# Altium schematic sheet RT1064_Power.SchDoc
size A4; SheetNumber: 4; SheetTotal: 4
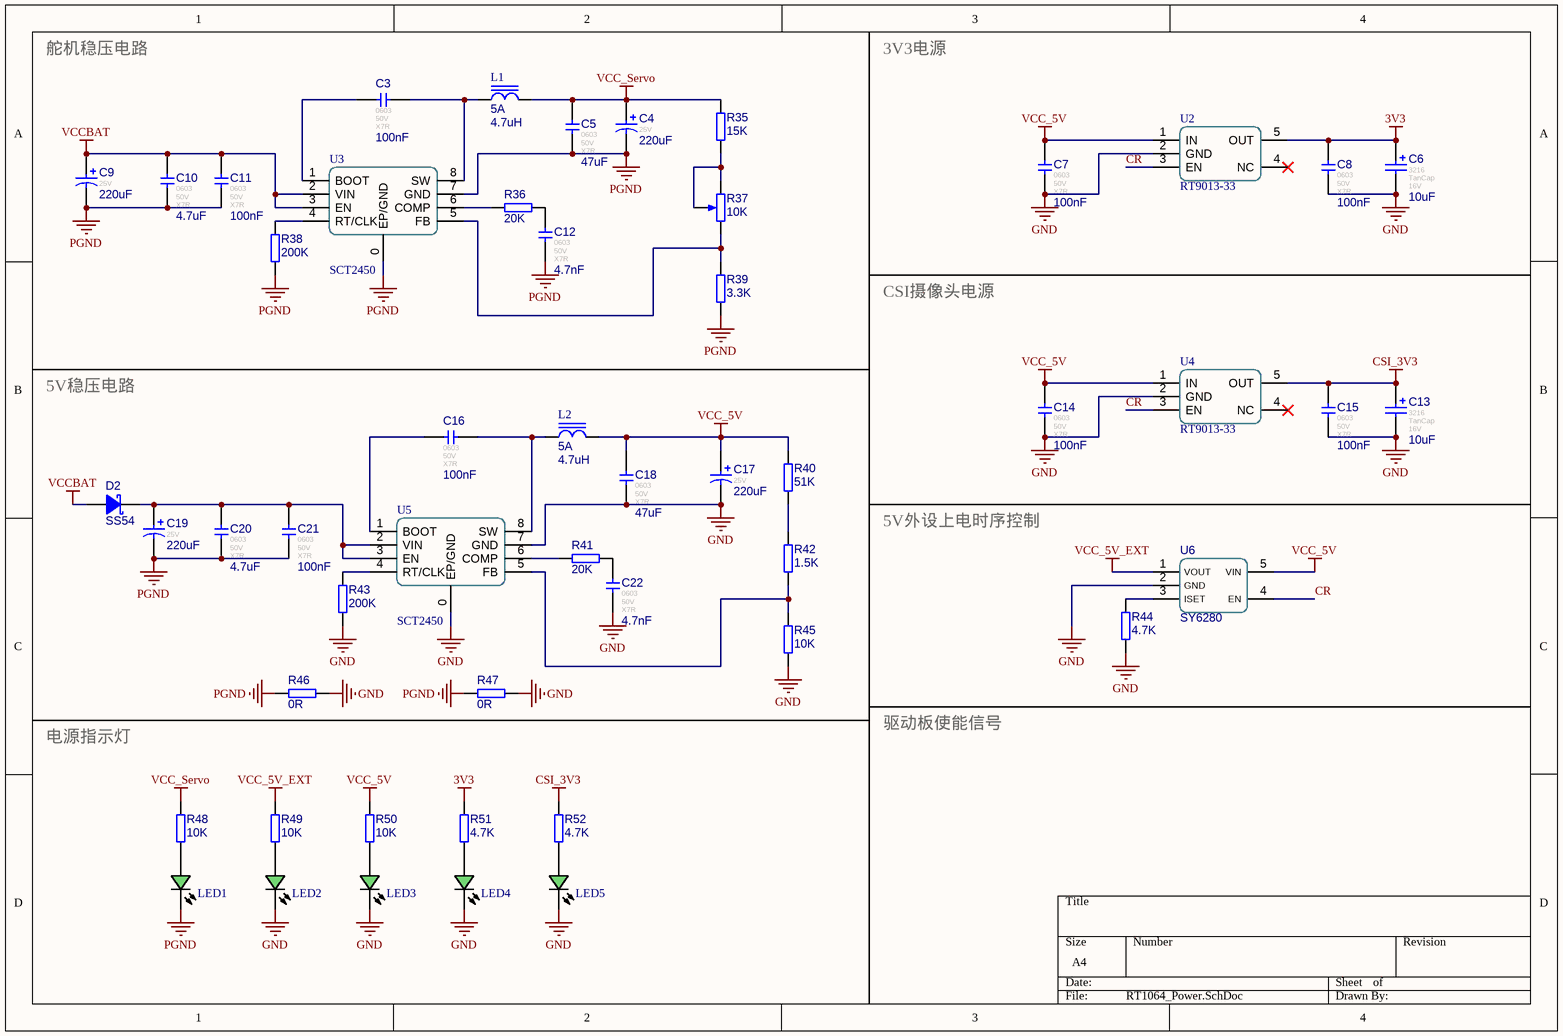
[diagram p0: RT1064_Power.SchDoc]

## Parts
C3  value 100nF  FootPrint: 0603  Voltage: 50V  Type: X7R  [CAPC1608[0603]S-L]  (hidden comment: 100nF 50V X7R)
C4  value 220uF  Voltage: 25V  [CAP-E-S 6.3]  (hidden comment: 220uF 25V 铝电解)
C5  value 47uF  FootPrint: 0603  Voltage: 50V  Type: X7R  [CAPC1608[0603]S-L]  (hidden comment: 47uF 50V X7R)
C6  value 10uF  FootPrint: 3216  Type: TanCap  Voltage: 16V  [CAP-T-S 3216]  (hidden comment: T-S 10uF 3216 16V)
C7  value 100nF  FootPrint: 0603  Voltage: 50V  Type: X7R  [CAPC1608[0603]S-L]  (hidden comment: 100nF 50V X7R)
C8  value 100nF  FootPrint: 0603  Voltage: 50V  Type: X7R  [CAPC1608[0603]S-L]  (hidden comment: 100nF 50V X7R)
C9  value 220uF  Voltage: 25V  [CAP-E-S 6.3]  (hidden comment: 220uF 25V 铝电解)
C10  value 4.7uF  FootPrint: 0603  Voltage: 50V  Type: X7R  [CAPC1608[0603]S-L]  (hidden comment: 4.7uF 50V X7R)
C11  value 100nF  FootPrint: 0603  Voltage: 50V  Type: X7R  [CAPC1608[0603]S-L]  (hidden comment: 100nF 50V X7R)
C12  value 4.7nF  FootPrint: 0603  Voltage: 50V  Type: X7R  [CAPC1608[0603]S-L]  (hidden comment: 4.7nF 50V X7R)
C13  value 10uF  FootPrint: 3216  Type: TanCap  Voltage: 16V  [CAP-T-S 3216]  (hidden comment: T-S 10uF 3216 16V)
C14  value 100nF  FootPrint: 0603  Voltage: 50V  Type: X7R  [CAPC1608[0603]S-L]  (hidden comment: 100nF 50V X7R)
C15  value 100nF  FootPrint: 0603  Voltage: 50V  Type: X7R  [CAPC1608[0603]S-L]  (hidden comment: 100nF 50V X7R)
C16  value 100nF  FootPrint: 0603  Voltage: 50V  Type: X7R  [CAPC1608[0603]S-L]  (hidden comment: 100nF 50V X7R)
C17  value 220uF  Voltage: 25V  [CAP-E-S 6.3]  (hidden comment: 220uF 25V 铝电解)
C18  value 47uF  FootPrint: 0603  Voltage: 50V  Type: X7R  [CAPC1608[0603]S-L]  (hidden comment: 47uF 50V X7R)
C19  value 220uF  Voltage: 25V  [CAP-E-S 6.3]  (hidden comment: 220uF 25V 铝电解)
C20  value 4.7uF  FootPrint: 0603  Voltage: 50V  Type: X7R  [CAPC1608[0603]S-L]  (hidden comment: 4.7uF 50V X7R)
C21  value 100nF  FootPrint: 0603  Voltage: 50V  Type: X7R  [CAPC1608[0603]S-L]  (hidden comment: 100nF 50V X7R)
C22  value 4.7nF  FootPrint: 0603  Voltage: 50V  Type: X7R  [CAPC1608[0603]S-L]  (hidden comment: 4.7nF 50V X7R)
D2  SS54  [SMA-L[DO-214AC]]
L1  value 4.7uH  Imax: 5A  [0630 TPC 7*7*3]  (hidden comment: 4.7uH 5A)
L2  value 4.7uH  Imax: 5A  [0630 TPC 7*7*3]  (hidden comment: 4.7uH 5A)
LED1  翠绿贴片LED  [LEDC1608(0603)-L]  (value not drawn)
LED2  翠绿贴片LED  [LEDC1608(0603)-L]  (value not drawn)
LED3  翠绿贴片LED  [LEDC1608(0603)-L]  (value not drawn)
LED4  翠绿贴片LED  [LEDC1608(0603)-L]  (value not drawn)
LED5  翠绿贴片LED  [LEDC1608(0603)-L]  (value not drawn)
R35  value 15K  [RESC1608[0603]S-L]  (hidden comment: 15K ±1%)
R36  value 20K  [RESC1608[0603]S-L]  (hidden comment: 20K ±1%)
R37  10K  [RESPOT3296W]
R38  value 200K  [RESC1608[0603]S-L]  (hidden comment: 200K ±1%)
R39  value 3.3K  [RESC1608[0603]S-L]  (hidden comment: 3.3K ±1%)
R40  value 51K  [RESC1608[0603]S-L]  (hidden comment: 51K ±1%)
R41  value 20K  [RESC1608[0603]S-L]  (hidden comment: 20K ±1%)
R42  value 1.5K  [RESC1608[0603]S-L]  (hidden comment: 1.5K ±1%)
R43  value 200K  [RESC1608[0603]S-L]  (hidden comment: 200K ±1%)
R44  value 4.7K  [RESC1608[0603]S-L]  (hidden comment: 4.7K ±1%)
R45  value 10K  [RESC1608[0603]S-L]  (hidden comment: 10K ±1%)
R46  value 0R  [RESC1608[0603]S-L]  (hidden comment: 0R ±1%)
R47  value 0R  [RESC1608[0603]S-L]  (hidden comment: 0R ±1%)
R48  value 10K  [RESC1608[0603]S-L]  (hidden comment: 10K ±1%)
R49  value 10K  [RESC1608[0603]S-L]  (hidden comment: 10K ±1%)
R50  value 10K  [RESC1608[0603]S-L]  (hidden comment: 10K ±1%)
R51  value 4.7K  [RESC1608[0603]S-L]  (hidden comment: 4.7K ±1%)
R52  value 4.7K  [RESC1608[0603]S-L]  (hidden comment: 4.7K ±1%)
U2  RT9013-33  [SOT-23-5]
U3  SCT2450  [SOP-8E]
U4  RT9013-33  [SOT-23-5]
U5  SCT2450  [SOP-8E]
U6  SY6280  [SOT-23-5]

## Nets
3V3: C6.1 C8.2 R51.2 U2.5(OUT)
CSI_3V3: C13.1 C15.2 R52.2 U4.5(OUT)
GND: C6.2 C7.1 C8.1 C13.2 C14.1 C15.1 C17.2 C18.1 C22.1 LED2.C LED3.C LED4.C LED5.C R43.1 R44.1 R45.1 R46.2 R47.2 U2.2(GND) U4.2(GND) U5.0(EP/GND) U5.7(GND) U6.2(GND)
PGND: C4.2 C5.1 C9.2 C10.1 C11.1 C12.1 C19.2 C20.1 C21.1 LED1.C R38.1 R39.1 R46.1 R47.1 U3.0(EP/GND) U3.7(GND)
VCC_5V: C7.2 C14.2 C17.1 C18.2 L2.2 R40.2 R50.2 U2.1(IN) U4.1(IN) U6.5(VIN)
VCC_5V_EXT: R49.2 U6.1(VOUT)
VCC_Servo: C4.1 C5.2 L1.2 R35.2 R48.2
VCCBAT: C9.1 C10.2 C11.2 D2.A U3.2(VIN) U3.3(EN)
CR: U2.3(EN) U4.3(EN) U6.4(EN)
NetC3_1: C3.1 L1.1 U3.8(SW)
NetC3_2: C3.2 U3.1(BOOT)
NetC12_2: C12.2 R36.1
NetC16_1: C16.1 L2.1 U5.8(SW)
NetC16_2: C16.2 U5.1(BOOT)
NetC19_1: C19.1 C20.2 C21.2 D2.K U5.2(VIN) U5.3(EN)
NetC22_2: C22.2 R41.1
NetLED1_A: LED1.A R48.1
NetLED2_A: LED2.A R49.1
NetLED3_A: LED3.A R50.1
NetLED4_A: LED4.A R51.1
NetLED5_A: LED5.A R52.1
NetR35_1: R35.1 R37.1(TOP) R37.ADJ
NetR36_2: R36.2 U3.6(COMP)
NetR37_2: R37.2(BOT) R39.2 U3.5(FB)
NetR38_2: R38.2 U3.4(RT/CLK)
NetR40_1: R40.1 R42.2
NetR41_2: R41.2 U5.6(COMP)
NetR42_1: R42.1 R45.2 U5.5(FB)
NetR43_2: R43.2 U5.4(RT/CLK)
NetR44_2: R44.2 U6.3(ISET)

Not connected (* = marked no-connect by the designer): U2 4(NC)*; U4 4(NC)*

## Notes on the sheet
- 舵机稳压电路
- 3V3电源
- CSI摄像头电源
- 5V稳压电路
- 5V外设上电时序控制
- 电源指示灯
- 驱动板使能信号

## Library data of the parts
C3 C5 C7 C8 C10 C11 C14-C16 C18 C20 C21 = 100nF 0603 50V X7R: 贴片瓷片电容; MLCC; 0603(1608);; Revision: V1.0
C4 C9 C17 C19 = E-S 220uF 25V 6.3x7.7: 贴片电解电容 220uF 25V 6.3x7.7; Revision: V1.0; Type: 铝电解
C6 C13 = T-S 10uF 3216 16V: 贴片钽电容 10uF 3216 16V; Revision: July-2002: Re-released for DXP Platform.
C12 C22 = 4.7nF 0603 50V X7R: 贴片瓷片电容; MLCC; 0603(1608);; Revision: V1.0
D2 = SS54: SS54 肖特基二极管; Revision: V1.0; Value: SS54
L1 L2 = Ind-Power: 功率电感; DCR: .5m; Published: 8-Jun-2000; Revision: July-2002: Re-released for DXP Platform.; Publisher: Altium Limited; Price(RMB): 0.000
LED1-LED5 = LED Chip Green: Published: 8-Jun-2000; Revision: July-2002: Re-released for DXP Platform.; Publisher: Altium Limited; Price(RMB): 0.00
R35 R36 R38-R45 R48-R52 = Res-Chip: 贴片电阻; Power: 1/8W; Revision: V1.0; Tolerance: ±1%
R37 = Res-Adj-3p: 可调电阻; Value: 10K
R46 R47 = Res-Chip_1: 贴片电阻; Power: 1/8W; Revision: V1.0; Tolerance: ±1%
U2 U4 = RT9013-33: 3.3V 500mA SOT-23-5 LDO
U3 U5 = SCT2450: 3.8V-36V Vin, 5A, High Efficiency Synchronous Step-down DCDC Converter / with Programmable Frequency
U6 = SY6280: SY6280 2A 限额配电开关; Imax: 2.1A; Published: 2020-12-08; Revision: V1.0